# Altium schematic sheet CPU_22032016_v2.SchDoc
size A3; PageSetup: Record=PageOptions|CenterHorizontal=True|CenterVertical=True|PrintScale=0.68|XCorrection=1.00|YCorrection=1.00|PrintKind=1|BorderSize=5000000|LeftOffset=0|BottomOffset=0|Orientation=2|PaperLength=1000|PaperWidth=1000|Scale=100|PaperSource=262|PrintQuality=-1|MediaType=1|DitherType=10|PrintScaleMode=1|PaperKind=Letter|PaperIndex=1
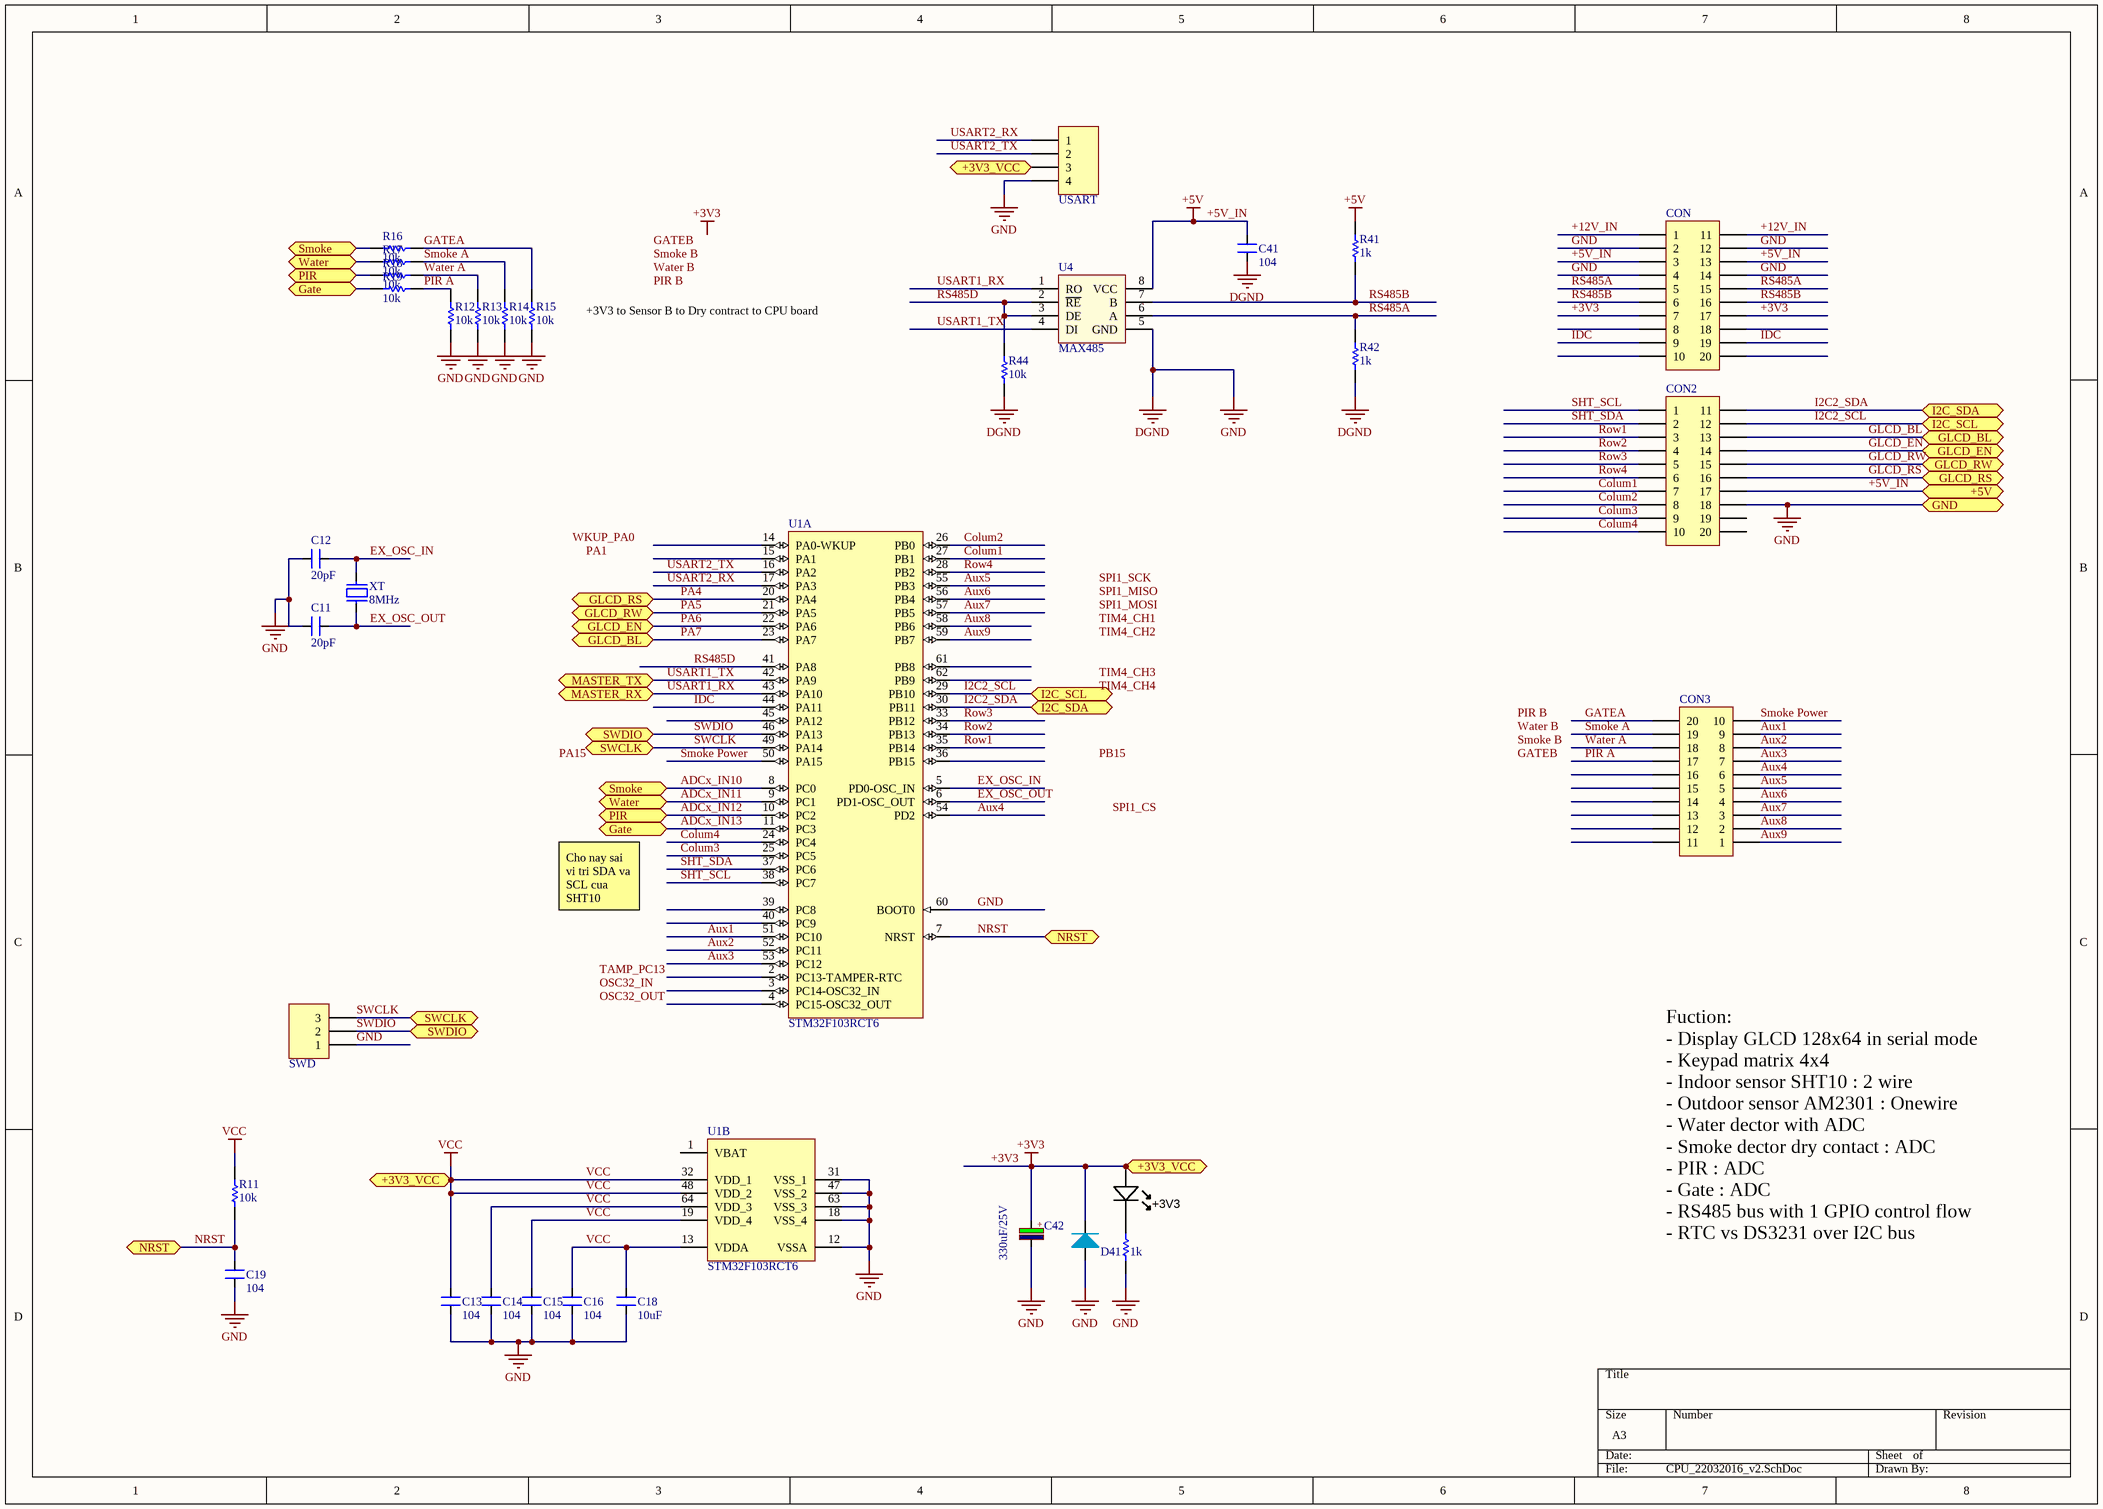
[diagram p0: CPU_22032016_v2.SchDoc]

## Parts
+3V3  Blue  [LED-0805-K]  (value not drawn)
C11  value 20pF  [CAPC1608N]  (hidden comment: Cap_22p_0603)
C12  value 20pF  [CAPC1608N]  (hidden comment: Cap_22p_0603)
C13  value 104  [CAPC1608N]  (hidden comment: Cap_104_0603)
C14  value 104  [CAPC1608N]  (hidden comment: Cap_104_0603)
C15  value 104  [CAPC1608N]  (hidden comment: Cap_104_0603)
C16  value 104  [CAPC1608N]  (hidden comment: Cap_104_0603)
C18  value 10uF  [CAPC2012N_F]  (hidden comment: Cap_10uF_0805)
C19  value 104  [CAPC1608N]  (hidden comment: Cap_104_0603)
C41  value 104  [CAPC2012N_F]  (hidden comment: 100nF/104)
C42  330uF/25V  [CAPMP3528X210N]
CON  Header 10X2A  [OMC10]  (value not drawn)
CON2  Header 10X2A  [OMC10]  (value not drawn)
CON3  Header 10X2A  [OMC10]  (value not drawn)
D41  Diode  [DO-214AC]  (value not drawn)
R11  value 10k  [RESC1608N_F]  (hidden comment: Res_10k_0603)
R12  value 10k  [RESC1608N_ZERO]  (hidden comment: Res)
R13  value 10k  [RESC1608N_ZERO]  (hidden comment: Res)
R14  value 10k  [RESC1608N_ZERO]  (hidden comment: Res)
R15  value 10k  [RESC1608N_ZERO]  (hidden comment: Res)
R16  value 10k  [RESC1608N_ZERO]  (hidden comment: Res)
R17  value 10k  [RESC1608N_ZERO]  (hidden comment: Res)
R18  value 10k  [RESC1608N_ZERO]  (hidden comment: Res)
R19  value 10k  [RESC1608N_ZERO]  (hidden comment: Res)
R41  1k  [RESC2012N_F]
R42  1k  [RESC2012N_F]
R44  value 10k  [RESC2012N_F]  (hidden comment: 330R)
Rled  value 1k  [RESC2012N_F]  (hidden comment: Res_0805_1k)
SWD  Header 3  [HDR1X3]  (value not drawn)
U1  STM32F103RCT6  [LQFP64_Tuan]  (parts A,B of 2)
U4  MAX485  [SO-8]
USART  Header 4  [HDR1X4]  (value not drawn)
XT  8MHz  [XT2]

## Ports
+3V3_VCC, +5V, Gate, GLCD_BL, GLCD_EN, GLCD_RS, GLCD_RW, GND, I2C_SCL, I2C_SDA, MASTER_RX, MASTER_TX, NRST, PIR, Smoke, SWCLK, SWDIO, Water

## Nets
+3V3: +3V3.A C13.2 C14.2 C15.2 C16.2 C18.2 C42.1 CON.7 CON.17 D41.2(K) R11.2 U1.13(VDDA) U1.19(VDD_4) U1.32(VDD_1) U1.48(VDD_2) U1.64(VDD_3) USART.3 ; port +3V3_VCC  [also labelled VCC]
+5V_IN: C41.2 CON.3 CON.13 CON2.17 R41.2 U4.8(VCC) ; port +5V  [also labelled +5V]
GND: C11.2 C12.2 C13.1 C14.1 C15.1 C16.1 C18.1 C19.1 C41.1 C42.2 CON.2 CON.4 CON.12 CON.14 CON2.18 D41.1(A) R12.2 R13.2 R14.1 R15.1 R42.1 R44.1 Rled.2 SWD.1 U1.12(VSSA) U1.18(VSS_4) U1.31(VSS_1) U1.47(VSS_2) U1.60(BOOT0) U1.63(VSS_3) U4.5(GND) USART.4 ; port GND  [also labelled DGND]
+12V_IN: CON.1 CON.11
ADCx_IN10: R16.1 U1.8(PC0) ; port Smoke
ADCx_IN11: R17.1 U1.9(PC1) ; port Water
ADCx_IN12: R18.1 U1.10(PC2) ; port PIR
ADCx_IN13: R19.1 U1.11(PC3) ; port Gate
Aux1: CON3.9 U1.51(PC10)
Aux2: CON3.8 U1.52(PC11)
Aux3: CON3.7 U1.53(PC12)
Aux4: CON3.6 U1.54(PD2)
Aux5: CON3.5 U1.55(PB3)
Aux6: CON3.4 U1.56(PB4)
Aux7: CON3.3 U1.57(PB5)
Aux8: CON3.2 U1.58(PB6)
Aux9: CON3.1 U1.59(PB7)
Colum1: CON2.7 U1.27(PB1)
Colum2: CON2.8 U1.26(PB0)
Colum3: CON2.9 U1.25(PC5)
Colum4: CON2.10 U1.24(PC4)
EX_OSC_IN: C12.1 U1.5(PD0-OSC_IN) XT.2
EX_OSC_OUT: C11.1 U1.6(PD1-OSC_OUT) XT.1
GATEA: CON3.20 R15.2 R16.2
GLCD_BL: CON2.13 U1.23(PA7) ; port GLCD_BL  [also labelled PA7]
GLCD_EN: CON2.14 U1.22(PA6) ; port GLCD_EN  [also labelled PA6]
GLCD_RS: CON2.16 U1.20(PA4) ; port GLCD_RS  [also labelled PA4]
GLCD_RW: CON2.15 U1.21(PA5) ; port GLCD_RW  [also labelled PA5]
I2C2_SCL: CON2.12 U1.29(PB10) ; port I2C_SCL
I2C2_SDA: CON2.11 U1.30(PB11) ; port I2C_SDA
IDC: CON.9 CON.19 U1.44(PA11)
NRST: C19.2 R11.1 U1.7(NRST) ; port NRST
PIR A: CON3.17 R12.1 R19.2
Row1: CON2.3 U1.35(PB14)
Row2: CON2.4 U1.34(PB13)
Row3: CON2.5 U1.33(PB12)
Row4: CON2.6 U1.28(PB2)
RS485A: CON.5 CON.15 R42.2 U4.6(A)
RS485B: CON.6 CON.16 R41.1 U4.7(B)
RS485D: R44.2 U1.41(PA8) U4.2(~{RE}) U4.3(DE)
SHT_SCL: CON2.1 U1.38(PC7)
SHT_SDA: CON2.2 U1.37(PC6)
Smoke A: CON3.19 R14.2 R17.2
Smoke Power: CON3.10 U1.50(PA15)
SWCLK: SWD.3 U1.49(PA14) ; port SWCLK
SWDIO: SWD.2 U1.46(PA13) ; port SWDIO
USART1_RX: U1.43(PA10) U4.1(RO) ; port MASTER_RX
USART1_TX: U1.42(PA9) U4.4(DI) ; port MASTER_TX
USART2_RX: U1.17(PA3) USART.1
USART2_TX: U1.16(PA2) USART.2
Water A: CON3.18 R13.1 R18.2
Net+3V3_K: +3V3.K Rled.1

Not connected (* = marked no-connect by the designer): CON 8 10 18 20; CON2 19 20; CON3 11 12 13 14 15 16; U1 1(VBAT) 2(PC13-TAMPER-RTC) 3(PC14-OSC32_IN) 4(PC15-OSC32_OUT) 14(PA0-WKUP) 15(PA1) 36(PB15) 39(PC8) 40(PC9) 45(PA12) 61(PB8) 62(PB9)

## Notes on the sheet
- +3V3 to Sensor B to Dry contract to CPU board
- Cho nay sai vi tri SDA va SCL cua SHT10
- Fuction:
  - Display GLCD 128x64 in serial mode
  - Keypad matrix 4x4
  - Indoor sensor SHT10 : 2 wire
  - Outdoor sensor AM2301 : Onewire
  - Water dector with ADC
  - Smoke dector dry contact : ADC
  - PIR : ADC
  - Gate : ADC
  - RS485 bus with 1 GPIO control flow
  - RTC vs DS3231 over I2C bus
- Labels drawn without touching a wire or pin: +3V3, GATEB, OSC32_IN, OSC32_OUT, PA1, PA15, PB15, PIR B, Smoke B, SPI1_CS, SPI1_MISO, SPI1_MOSI, SPI1_SCK, TAMP_PC13, TIM4_CH1, TIM4_CH2, TIM4_CH3, TIM4_CH4, Water B, WKUP_PA0
- (in symbol CP4) +

## Library data of the parts
+3V3 = LED_SMD_Blue_0805_100mcd: LED 0805 SMD Blue 100mcd 470nm; Manufacturer 1: Ligitek; Manufacturer Part Number 1: LG-170DBKZ-CT; Ratings: 100 mcd; 470 nm; Package / Case: 0805; Material: InGaN/GaN; Value: Blue; Color: Blue
C11-C16 C18 C19 C41 = CAP NP
C42 = CP4: Cap 1000uF/16V - 220uF/50V; Description 5: 4,7uF>10uF/250V_3,3uF>10uF/400V - 2,2uF>4,7uF/450V; Description 1: 2200uF-3300uF/6,3V - 1000uF-2200uF/10V; Description 2: 1000uF/16V - 470uF => 1000uF/25V - 100uF/100V; Description 3: 330uF>470uF/35V_220uF>470uF/50V_10uF>22uF/250V; Description 4: 220uF => 330uF/63V - 10uF =>33uF/160 - 200V; Value: 1000uF/16V
CON CON2 CON3 = Header 10X2A: Header, 10-Pin, Dual row; LatestRevisionDate: 17-Jul-2002; LatestRevisionNote: Re-released for DXP Platform.; Publisher: Altium Limited
D41 = Diode: pin to pad: 1>A 2>K
R11 Rled = Res
R41 R42 R44 = Res: Tro dan
  R41 R42: Value: 1k
SWD = Header 3: Header, 3-Pin; LatestRevisionDate: 17-Jul-2002; LatestRevisionNote: Re-released for DXP Platform.; Publisher: Altium Limited
U1 = STM32F103RCT6: ARM Cortex-M3 32-bit MCU, 256 KB Flash, 48 KB Internal RAM, 51 I/Os, 64-pin LQFP, -40 to 85 degC, Tray; A/D Converter: 3x12-bit (16 Channel); D/A Converter: 2x12-bit (2 Channel); FLASH Size (Prog) (kB): 256; I/Os (High Current): 51; Internal RAM Size (kB): 48; Operating Frequency(F) (Processor speed) (MHz): 72; Supply Voltage(Vcc) min (V): 2; DatasheetVersion: Rev. 8; PackageVersion: Rev. 4, 06/2013; PackageReference: LQFP64; PackageDescription: 64-Pin Low Profile Quad Flat Package, 10 x 10 mm Body, 0.5 mm Pitch; Supplier 1: Digi-Key; Supplier Part Number 1: 497-9033-ND; Supplier 2: Newark; Supplier Part Number 2: 01P4099; Supplier 3: Newark; Supplier Part Number 3: 57P1227; Supplier 4: Mouser; Supplier Part Number 4: 511-STM32F103RCT6; Core: ARM Cortex-M3; Packing: Tray; Mounting Technology: Surface Mount; PartNumber: STM32F103RCT6; ComponentLink1Description: Manufacturer URL; ComponentLink1URL: http://www.st.com/web/en/home.html; ComponentLink2Description: Datasheet; ComponentLink2URL: http://www.st.com/st-web-ui/static/active/en/resource/technical/document/datasheet/CD00191185.pdf; ComponentLink3Description: Package Specification; ComponentLink3URL: http://www.st.com/st-web-ui/static/active/en/resource/technical/document/datasheet/DM00037051.pdf
U4 = MAX485: RS232 - RS485 (Same sn75176)
USART = Header 4: Header, 4-Pin; LatestRevisionDate: 17-Jul-2002; LatestRevisionNote: Re-released for DXP Platform.; Publisher: Altium Limited
XT = Crystal